# EasyEDA Pro project ELECAP.eprj, schematic Signal_process
Create Date: 2024-07-16; Page Name: P1; Project Name: ELECAP; Schematic Name: Signal_process; Update Date: 2024-07-20; Company: 嘉立创EDA; Page Size: A4; Version: V1.0
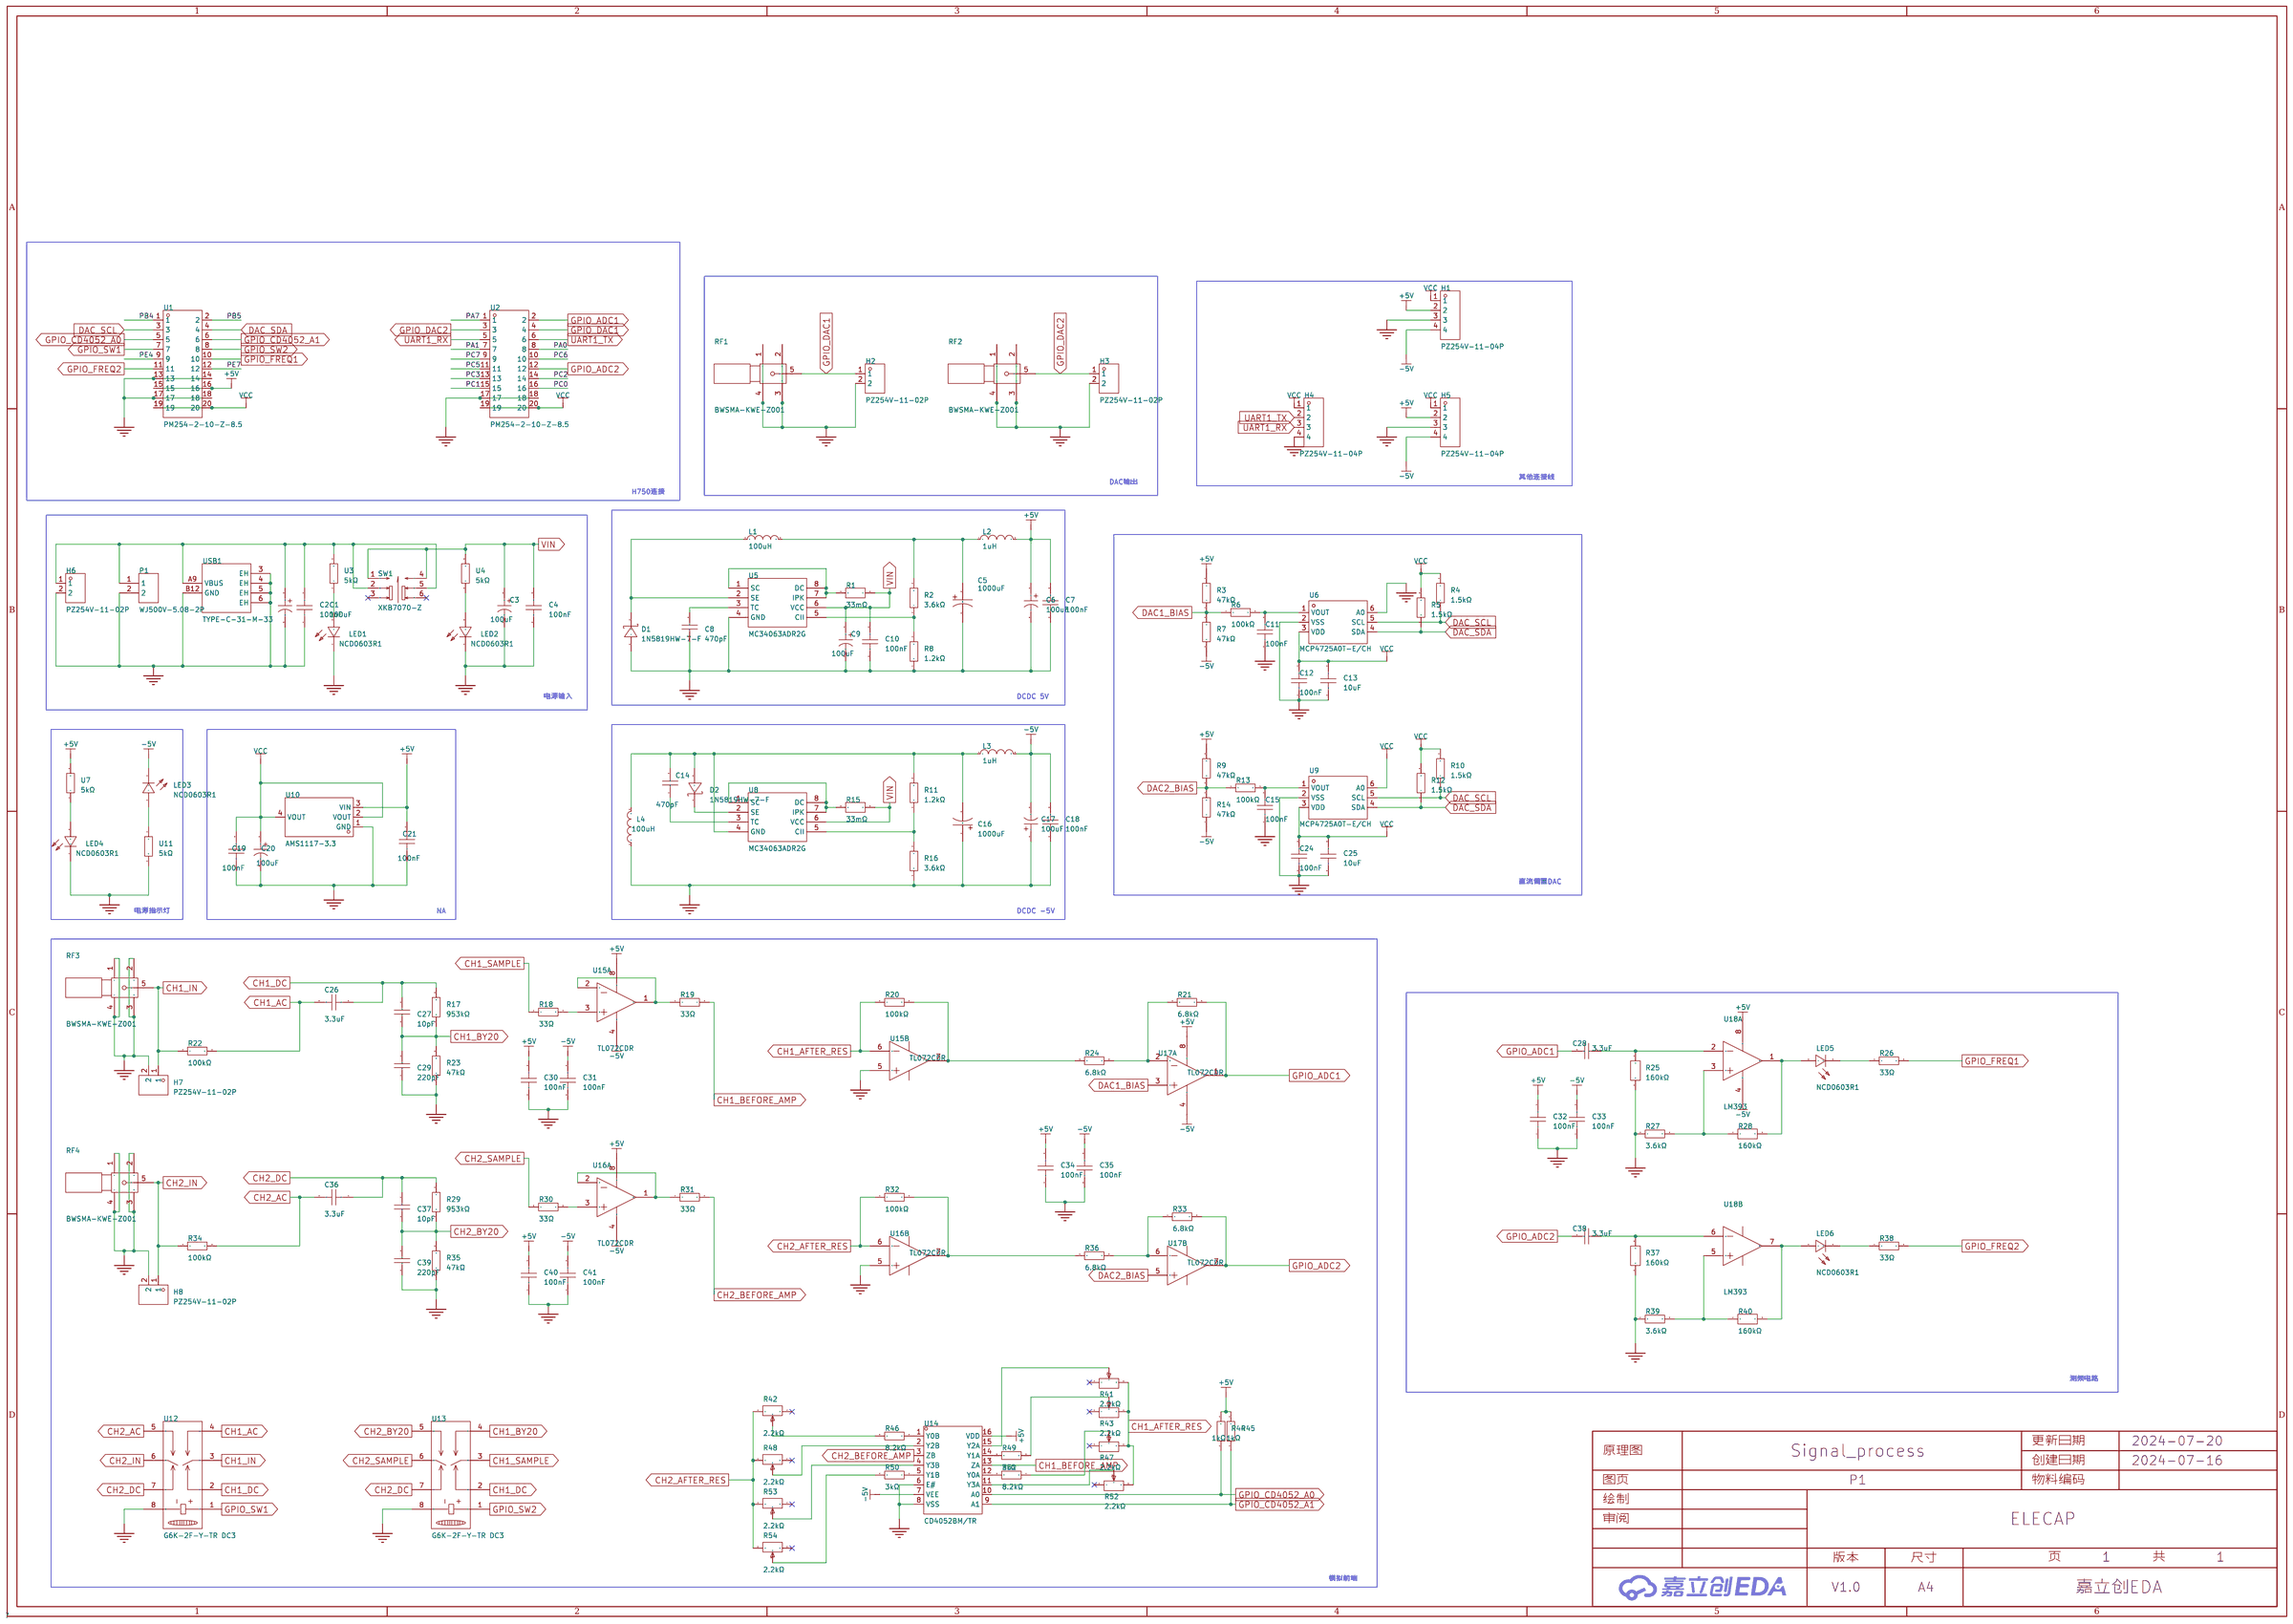
[diagram p0: schematic sheet]

## Parts
C1  100uF  [CAP-SMD_BD6.3-L6.6-W6.6-LS7.4-FD]
C2  100nF  [C0603]
C3  100uF  [CAP-SMD_BD6.3-L6.6-W6.6-LS7.4-FD]
C4  100nF  [C0603]
C5  1000uF  [CAP-TH_BD10.0-P5.00-D1.0-FD]
C6  100uF  [CAP-SMD_BD6.3-L6.6-W6.6-LS7.4-FD]
C7  100nF  [C0603]
C8  470pF  [C0603]
C9  100uF  [CAP-SMD_BD6.3-L6.6-W6.6-LS7.4-FD]
C10  100nF  [C0603]
C11  100nF  [C0603]
C12  100nF  [C0603]
C13  10uF  [C0603]
C14  470pF  [C0603]
C15  100nF  [C0603]
C16  1000uF  [CAP-TH_BD10.0-P5.00-D1.0-FD]
C17  100uF  [CAP-SMD_BD6.3-L6.6-W6.6-LS7.4-FD]
C18  100nF  [C0603]
C19  100nF  [C0603]
C20  100uF  [CAP-SMD_BD6.3-L6.6-W6.6-LS7.4-FD]
C21  100nF  [C0603]
C24  100nF  [C0603]
C25  10uF  [C0603]
C26  3.3uF  [C0603]
C27  10pF  [C0603]
C28  3.3uF  [C0603]
C29  220pF  [C0603]
C30  100nF  [C0603]
C31  100nF  [C0603]
C32  100nF  [C0603]
C33  100nF  [C0603]
C34  100nF  [C0603]
C35  100nF  [C0603]
C36  3.3uF  [C0603]
C37  10pF  [C0603]
C38  3.3uF  [C0603]
C39  220pF  [C0603]
C40  100nF  [C0603]
C41  100nF  [C0603]
D1  1N5819HW-7-F  [SOD-123_L2.7-W1.6-LS3.7-RD]
D2  1N5819HW-7-F  [SOD-123_L2.7-W1.6-LS3.7-RD]
H1  PZ254V-11-04P  [HDR-TH_4P-P2.54-V-M]
H2  PZ254V-11-02P  [HDR-TH_2P-P2.54-V-M]
H3  PZ254V-11-02P  [HDR-TH_2P-P2.54-V-M]
H4  PZ254V-11-04P  [HDR-TH_4P-P2.54-V-M]
H5  PZ254V-11-04P  [HDR-TH_4P-P2.54-V-M]
H6  PZ254V-11-02P  [HDR-TH_2P-P2.54-V-M]
H7  PZ254V-11-02P  [HDR-TH_2P-P2.54-V-M]
H8  PZ254V-11-02P  [HDR-TH_2P-P2.54-V-M]
L1  100uH  [IND-SMD_L7.1-W6.6]
L2  1uH  [IND-SMD_L4.4-W4.2]
L3  1uH  [IND-SMD_L4.4-W4.2]
L4  100uH  [IND-SMD_L7.1-W6.6]
LED1  NCD0603R1  [LED0603-RD_RED]
LED2  NCD0603R1  [LED0603-RD_RED]
LED3  NCD0603R1  [LED0603-RD_RED]
LED4  NCD0603R1  [LED0603-RD_RED]
LED5  NCD0603R1  [LED0603-RD_RED]
LED6  NCD0603R1  [LED0603-RD_RED]
P1  WJ500V-5.08-2P  [CONN-TH_2P-P5.00_WJ500V-5.08-2P]
R1  33mΩ  [R2512]
R2  3.6kΩ  [R0603]
R3  47kΩ  [R0603]
R4  1.5kΩ  [R0603]
R5  1.5kΩ  [R0603]
R6  100kΩ  [R0603]
R7  47kΩ  [R0603]
R8  1.2kΩ  [R0603]
R9  47kΩ  [R0603]
R10  1.5kΩ  [R0603]
R11  1.2kΩ  [R0603]
R12  1.5kΩ  [R0603]
R13  100kΩ  [R0603]
R14  47kΩ  [R0603]
R15  33mΩ  [R2512]
R16  3.6kΩ  [R0603]
R17  953kΩ  [R0603]
R18  33Ω  [R0603]
R19  33Ω  [R0603]
R20  100kΩ  [R0603]
R21  6.8kΩ  [R0603]
R22  100kΩ  [R0603]
R23  47kΩ  [R0603]
R24  6.8kΩ  [R0603]
R25  160kΩ  [R0603]
R26  33Ω  [R0603]
R27  3.6kΩ  [R0603]
R28  160kΩ  [R0603]
R29  953kΩ  [R0603]
R30  33Ω  [R0603]
R31  33Ω  [R0603]
R32  100kΩ  [R0603]
R33  6.8kΩ  [R0603]
R34  100kΩ  [R0603]
R35  47kΩ  [R0603]
R36  6.8kΩ  [R0603]
R37  160kΩ  [R0603]
R38  33Ω  [R0603]
R39  3.6kΩ  [R0603]
R40  160kΩ  [R0603]
R41  2.2kΩ  [RES-ADJ-SMD_VG039NCH]
R42  2.2kΩ  [RES-ADJ-SMD_VG039NCH]
R43  2.2kΩ  [RES-ADJ-SMD_VG039NCH]
R44  1kΩ  [R0603]
R45  1kΩ  [R0603]
R46  8.2kΩ  [R0603]
R47  2.2kΩ  [RES-ADJ-SMD_VG039NCH]
R48  2.2kΩ  [RES-ADJ-SMD_VG039NCH]
R49  3kΩ  [R0603]
R50  3kΩ  [R0603]
R51  8.2kΩ  [R0603]
R52  2.2kΩ  [RES-ADJ-SMD_VG039NCH]
R53  2.2kΩ  [RES-ADJ-SMD_VG039NCH]
R54  2.2kΩ  [RES-ADJ-SMD_VG039NCH]
RF1  BWSMA-KWE-Z001  [SMA-TH_BWSMA-KWE-Z001]
RF2  BWSMA-KWE-Z001  [SMA-TH_BWSMA-KWE-Z001]
RF3  BWSMA-KWE-Z001  [SMA-TH_BWSMA-KWE-Z001]
RF4  BWSMA-KWE-Z001  [SMA-TH_BWSMA-KWE-Z001]
SW1  XKB7070-Z  [SW-TH_6P-L7.0-W7.0-P2.00]
U1  PM254-2-10-Z-8.5  [HDR-TH_20P-P2.54-V-F-R2-C10-S2.54]
U2  PM254-2-10-Z-8.5  [HDR-TH_20P-P2.54-V-F-R2-C10-S2.54]
U3  5kΩ  [R0603]
U4  5kΩ  [R0603]
U5  MC34063ADR2G  [SOIC-8_L5.0-W4.0-P1.27-LS6.0-BL]
U6  MCP4725A0T-E/CH  [SOT-23-6_L2.9-W1.6-P0.95-LS2.8-BL]
U7  5kΩ  [R0603]
U8  MC34063ADR2G  [SOIC-8_L5.0-W4.0-P1.27-LS6.0-BL]
U9  MCP4725A0T-E/CH  [SOT-23-6_L2.9-W1.6-P0.95-LS2.8-BL]
U10  AMS1117-3.3  [SOT-223-3_L6.5-W3.4-P2.30-LS7.0-BR]
U11  5kΩ  [R0603]
U12  G6K-2F-Y-TR DC3  [RELAY-SMD_G6K-2F-Y]
U13  G6K-2F-Y-TR DC3  [RELAY-SMD_G6K-2F-Y]
U14  CD4052BM/TR  [SOP-16_L10.0-W3.9-P1.27-LS6.0-BL]
U15  TL072CDR  [SOIC-8_L4.9-W3.9-P1.27-LS6.1-BL]  (sections 1,2)
U16  TL072CDR  [SOIC-8_L4.9-W3.9-P1.27-LS6.1-BL]  (sections 1,2)
U17  TL072CDR  [SOIC-8_L4.9-W3.9-P1.27-LS6.1-BL]  (sections 1,2)
U18  LM393  [SOP-8_L4.9-W3.9-P1.27-LS6.0-BL]  (sections 1,2)
USB1  TYPE-C-31-M-33  [USB-C-TH_TYPE-C-31-M-33]

## Library data of the parts
C1 C3 C6 C9 C17 C20 = RVT100UF35V67RV0034: 容值:100uF;精度:±20%;额定电压:35V;纹波电流:87mA@120kHz;等效串联电阻:-;; LCSC Part Name: 100uF ±20% 35V; Supplier Part: C2836442; Manufacturer: KNSCHA(科尼盛); Supplier Footprint: SMD,D6.3xL7.7mm; JLCPCB Part Class: 扩展库; Datasheet: https://atta.szlcsc.com/upload/public/pdf/source/20210528/C2836442_7F6389BF36F63F32D6DF3A507E8E95D6.pdf; Supplier: LCSC; Tolerance: ±20%; Rated Voltage: 35V; Ripple Current: 87mA@120kHz; φD: 6.3mm; L: 7.7mm; Lifetime @ Temp: 2000hrs@105℃; Operating Temperature: -55℃~+105℃
C2 C4 C7 C10-C12 C15 C18 C19 C21 C24 C30-C35 C40 C41 = CC0603KRX7R9BB104: 容值:100nF;精度:±10%;额定电压:50V;材质(温度系数):X7R;; LCSC Part Name: 100nF ±10% 50V; Supplier Part: C14663; Manufacturer: YAGEO(国巨); Supplier Footprint: 0603; JLCPCB Part Class: 基础库; Datasheet: https://atta.szlcsc.com/upload/public/pdf/source/20180910/C282072_33301C7F631E79921B82A8DAC6BCC5B3.pdf; Supplier: LCSC; Tolerance: ±10%; Voltage Rated: 50V; Temperature Coefficient: X7R
C5 C16 = ERR1VM102G20OT: 容值:1000uF;精度:±20%;额定电压:35V;; LCSC Part Name: 1000uF ±20% 35V; Supplier Part: C398835; Manufacturer: AISHI(艾华集团); Supplier Footprint: 插件,D10xL20mm; JLCPCB Part Class: 扩展库; Datasheet: https://atta.szlcsc.com/upload/public/pdf/source/20190702/C401591_1676EF45BC9A88BD1D6B22BBAE3913C7.pdf; Supplier: LCSC; Tolerance: ±20%; Rated Voltage: 35V; Lead Spacing: 5mm; φD: 10mm; L: 20mm; Lifetime @ Temp: 2000hrs@105℃
C8 C14 = 0603B471K500NT: 容值:470pF;精度:±10%;额定电压:50V;材质(温度系数):X7R;; LCSC Part Name: 470pF ±10% 50V; Supplier Part: C1620; Manufacturer: FH(风华); Supplier Footprint: 0603; JLCPCB Part Class: 基础库; Datasheet: https://atta.szlcsc.com/upload/public/pdf/source/20200305/C486355_26A10D38EF8C2A5C37091D0039909270.pdf; Supplier: LCSC; Tolerance: ±10%; Voltage Rated: 50V; Temperature Coefficient: X7R
C13 C25 = CL10A106MQ8NNNC: 容值:10uF;精度:±20%;额定电压:6.3V;材质(温度系数):X5R;; LCSC Part Name: 10uF ±20% 6.3V; Supplier Part: C1691; Manufacturer: SAMSUNG(三星); Supplier Footprint: 0603; JLCPCB Part Class: 扩展库; Datasheet: https://atta.szlcsc.com/upload/public/pdf/source/20160218/1457707763339.pdf; Supplier: LCSC; Tolerance: ±20%; Voltage Rated: 6.3V; Temperature Coefficient: X5R
C26 C36 = C1608X5R1E335KT000E: 容值:3.3uF;精度:±10%;额定电压:25V;材质(温度系数):X5R;; LCSC Part Name: 3.3uF ±10% 25V; Supplier Part: C342962; Manufacturer: TDK; Supplier Footprint: 0603; JLCPCB Part Class: 扩展库; Datasheet: https://atta.szlcsc.com/upload/public/pdf/source/20190612/C361180_85CC9FB0751BEA97238DE56AB4AF0B1F.pdf; Supplier: LCSC; Tolerance: ±10%; Voltage Rated: 25V; Temperature Coefficient: X5R
C27 C37 = CL10C100JB8NNNC: 容值:10pF;精度:±5%;额定电压:50V;材质(温度系数):C0G;; LCSC Part Name: 10pF ±5% 50V; Supplier Part: C1634; Manufacturer: SAMSUNG(三星); Supplier Footprint: 0603; JLCPCB Part Class: 基础库; Datasheet: https://atta.szlcsc.com/upload/public/pdf/source/20160218/1457707763339.pdf; Supplier: LCSC; Tolerance: ±5%; Voltage Rated: 50V; Temperature Coefficient: C0G
C28 C38 = CL10A335KP8NNNC: 容值:3.3uF;精度:±10%;额定电压:10V;材质(温度系数):X5R;; LCSC Part Name: 3.3uF ±10% 10V; Supplier Part: C51412; Manufacturer: SAMSUNG(三星); Supplier Footprint: 0603; JLCPCB Part Class: 扩展库; Datasheet: https://atta.szlcsc.com/upload/public/pdf/source/20160218/1457707763339.pdf; Supplier: LCSC; Tolerance: ±10%; Voltage Rated: 10V; Temperature Coefficient: X5R
C29 C39 = CL10B221KB8NNNC: 容值:220pF;精度:±10%;额定电压:50V;材质(温度系数):X7R;; LCSC Part Name: 220pF ±10% 50V; Supplier Part: C1603; Manufacturer: SAMSUNG(三星); Supplier Footprint: 0603; JLCPCB Part Class: 基础库; Datasheet: https://atta.szlcsc.com/upload/public/pdf/source/20160218/1457707763339.pdf; Supplier: LCSC; Tolerance: ±10%; Voltage Rated: 50V; Temperature Coefficient: X7R
D1 D2 = 1N5819HW-7-F: 正向压降(Vf):450mV@1A;直流反向耐压(Vr):40V;平均整流电流(Io):1A;; LCSC Part Name: 电压:40V 电流:1A; Supplier Part: C82544; Manufacturer: DIODES(美台); Supplier Footprint: SOD-123; JLCPCB Part Class: 扩展库; Datasheet: https://atta.szlcsc.com/upload/public/pdf/source/20161024/1477288459223.pdf; Supplier: LCSC; Forward Voltage (Vf@If): 450mV@1A; Reverse Voltage (Vr): 40V; Average Rectified Current (Io): 1A; Reverse Leakage Current (Ir): 1mA@40V
H1 H4 H5 = PZ254V-11-04P: 插针结构:1x4P;间距:2.54mm;行距:-;圆针/方针:方针;安装类型:直插;排数:单排;总PIN位数:4P;额定电流:3A;额定电压:250V;配合针长度:6mm;塑高:2.5mm;端接针长度:3mm;触头材质:-;工作温度范围:-40℃~+105℃;颜色:黑色;; LCSC Part Name: 间距:2.54mm 1x4P 直插 方针; Supplier Part: C2691448; Manufacturer: XFCN(兴飞); Supplier Footprint: 插件,P=2.54mm; JLCPCB Part Class: Extended Part; Datasheet: https://atta.szlcsc.com/upload/public/pdf/source/20200309/C492403_F9F19131791D08044AD4F84F8E751A34.pdf; Supplier: LCSC; Pin Structure: 1x4P; Pitch: 2.54mm; Circluar Pins/Square Pins: 方针; Mounting Type: 直插; Number of Rows: 单排; Number of Pins: 4P; Current Rating (Max): 3A; Voltage Rating (Max): 250V; Length of Mating Pin: 6mm; Insulation Height: 2.5mm; Length of End Connection Pin: 3mm; Operating Temperature Range: -40℃~+105℃; Color: 黑色
H2 H3 H6-H8 = PZ254V-11-02P: 插针结构:1x2P;间距:2.54mm;行距:-;圆针/方针:方针;安装类型:直插;排数:单排;总PIN位数:2P;额定电流:-;额定电压:-;配合针长度:6mm;塑高:2.5mm;端接针长度:3mm;触头材质:黄铜;触头镀层:-;工作温度范围:-40℃~+105℃;颜色:黑色;; LCSC Part Name: 间距:2.54mm 1x2P 直插 方针; Supplier Part: C492401; Manufacturer: XFCN(兴飞); Supplier Footprint: 插件,P=2.54mm; JLCPCB Part Class: 扩展库; Datasheet: https://atta.szlcsc.com/upload/public/pdf/source/20200309/C492401_A812433581A9B211A7FFA413ADDFF0E5.pdf; Supplier: LCSC; Pin Structure: 1x2P; Pitch: 2.54mm; Circluar Pins/Square Pins: 方针; Mounting Type: 直插; Number of Rows: 单排; Number of Pins: 2P; Length of Mating Pin: 6mm; Insulation Height: 2.5mm; Length of End Connection Pin: 3mm; Contact Material: 黄铜; Operating Temperature Range: -40℃~+105℃; Color: 黑色
L1 L4 = SMMS0650-101M: 电感值:100uH;精度:±20%;额定电流:1.5A;饱和电流(Isat):2A;类型:一体成型电感;; LCSC Part Name: 100uH ±20% 2A; Supplier Part: C2894722; Manufacturer: SXN(顺翔诺); Supplier Footprint: SMD,6.6x7.1mm; JLCPCB Part Class: 扩展库; Datasheet: https://atta.szlcsc.com/upload/public/pdf/source/20210910/523B6BB0C4A09F37806A127B1ABE761D.pdf; Supplier: LCSC; Tolerance: ±20%; Rated Current: 1.5A; Saturation Current (Isat): 2A; DC Resistance (DCR): 720mΩ; Type: 一体成型电感
L2 L3 = FXL0420-1R0-M: 电感值:1uH;精度:±20%;额定电流:6A;饱和电流(Isat):7A;类型:一体成型电感;; LCSC Part Name: 1uH ±20% 7A; Supplier Part: C167203; Manufacturer: cjiang(长江微电); Supplier Footprint: SMD,4.2x4.4mm; JLCPCB Part Class: 扩展库; Datasheet: https://atta.szlcsc.com/upload/public/pdf/source/20230516/FBADA9890E7FBE97C620F1D8B562D733.pdf; Supplier: LCSC; Tolerance: ±20%; Rated Current: 6A; Saturation Current (Isat): 7A; DC Resistance (DCR): 27mΩ; Type: 一体成型电感
LED1-LED6 = NCD0603R1_C84263: 灯头类型:-;发光颜色:红色;正向电压(VF):1.6V~2.6V;功率:65mW;正向电流:20mA;主波长:615nm~630nm;二极管配置:独立二极管;透镜颜色:无色透明透镜;色温:-;发光强度:80mcd~220mcd;发光角度:130°;载带方式:-;工作温度:-30℃~+85℃;; Supplier Part: C84263; Manufacturer: 国星光电; Supplier Footprint: 0603; JLCPCB Part Class: 扩展库; Datasheet: https://atta.szlcsc.com/upload/public/pdf/source/20200820/C84263_DABC6A75E58F576973B407FDBA283D60.pdf; Supplier: LCSC; Emitted Color: 红色; Forward Voltage (VF): 1.6V~2.6V; Power Dissipation: 65mW; Forward Current: 20mA; Dominant Wavelength: 615nm~630nm; Diode Configuration: 独立二极管; Lens Color: 无色透明透镜; Luminous Intensity: 80mcd~220mcd; Viewing Angle: 130°; Operating Temperature: -30℃~+85℃
P1 = WJ500V-5.08-2P: 结构:1x2P;间距:5.08mm;颜色:绿色;安装方式:直插;额定电流:18A;额定电压:250V;排数:1;线规 - AWG:14~30;线规 - 平方毫米:2.5;每排PIN数:2;触头材质:-;触头镀层:-;工作温度范围:-40℃~+105℃;焊接温度(最大值):-;; LCSC Part Name: 1x2P 5.08mm 直插 排数:1 每排P数:2; Supplier Part: C8465; Manufacturer: KANGNEX(康奈克斯电气); Supplier Footprint: 插件,P=5.08mm; JLCPCB Part Class: 扩展库; Datasheet: https://atta.szlcsc.com/upload/public/pdf/source/20191225/C8465_02D34CE5B5B4A53DF5891601D97FA9F4.pdf; Supplier: LCSC; Structure: 1x2P; Pitch: 5.08mm; Color: 绿色; Mounting Style: 直插; Current Rating (Max): 18A; Voltage Rating (Max): 250V; Number of Pins: 2P; Number of Rows: 1; Wire Gauge - AWG: 14~30; Wire Gauge - mm2: 2.5; Number of PINs Per Row: 2; Operating Temperature Range: -40℃~+105℃; Screw Specification: M2.5
R1 R15 = 25121WF330MT4E: 电阻类型:厚膜电阻;阻值:33mΩ;精度:±1%;功率:1W;最大工作电压:200V;; LCSC Part Name: 33mΩ ±1% 1W 厚膜电阻; Supplier Part: C620828; Manufacturer: UNI-ROYAL(厚声); Supplier Footprint: 2512; JLCPCB Part Class: 扩展库; Datasheet: https://atta.szlcsc.com/upload/public/pdf/source/20200306/C422600_1E6D84923E4A46A82E41ADD87F860B5C.pdf; Supplier: LCSC; Type: 厚膜电阻; Tolerance: ±1%; Power(Watts): 1W; Overload Voltage (Max): 200V; Operating Temperature Range: -55℃~+155℃
R2 R16 = 0603WAF3601T5E: 电阻类型:厚膜电阻;阻值:3.6kΩ;精度:±1%;功率:100mW;最大工作电压:75V;温度系数:±100ppm/℃;; LCSC Part Name: 3.6kΩ ±1% 100mW 厚膜电阻; Supplier Part: C22980; Manufacturer: UNI-ROYAL(厚声); Supplier Footprint: 0603; JLCPCB Part Class: 基础库; Datasheet: https://atta.szlcsc.com/upload/public/pdf/source/20200306/C422600_1E6D84923E4A46A82E41ADD87F860B5C.pdf; Supplier: LCSC; Type: 厚膜电阻; Tolerance: ±1%; Power(Watts): 100mW; Overload Voltage (Max): 75V; Temperature Coefficient: ±100ppm/℃; Operating Temperature Range: -55℃~+155℃
R3 R7 R9 R14 R23 R35 = 0603WAF4702T5E: 电阻类型:厚膜电阻;阻值:47kΩ;精度:±1%;功率:100mW;最大工作电压:75V;温度系数:±100ppm/℃;; LCSC Part Name: 47kΩ ±1% 100mW 厚膜电阻; Supplier Part: C25819; Manufacturer: UNI-ROYAL(厚声); Supplier Footprint: 0603; JLCPCB Part Class: 基础库; Datasheet: https://atta.szlcsc.com/upload/public/pdf/source/20200306/C422600_1E6D84923E4A46A82E41ADD87F860B5C.pdf; Supplier: LCSC; Type: 厚膜电阻; Tolerance: ±1%; Power(Watts): 100mW; Overload Voltage (Max): 75V; Temperature Coefficient: ±100ppm/℃; Operating Temperature Range: -55℃~+155℃
R4 R5 R10 R12 = 0603WAF1501T5E: 电阻类型:厚膜电阻;阻值:1.5kΩ;精度:±1%;功率:100mW;最大工作电压:75V;温度系数:±100ppm/℃;; LCSC Part Name: 1.5kΩ ±1% 100mW 厚膜电阻; Supplier Part: C22843; Manufacturer: UNI-ROYAL(厚声); Supplier Footprint: 0603; JLCPCB Part Class: 基础库; Datasheet: https://atta.szlcsc.com/upload/public/pdf/source/20200306/C422600_1E6D84923E4A46A82E41ADD87F860B5C.pdf; Supplier: LCSC; Type: 厚膜电阻; Tolerance: ±1%; Power(Watts): 100mW; Overload Voltage (Max): 75V; Temperature Coefficient: ±100ppm/℃; Operating Temperature Range: -55℃~+155℃
R6 R13 R22 R34 = RC0603FR-07100KL: 电阻类型:厚膜电阻;阻值:100kΩ;精度:±1%;功率:100mW;最大工作电压:75V;温度系数:±100ppm/℃;; LCSC Part Name: 厚膜电阻 100kΩ ±1% 100mW; Supplier Part: C14675; Manufacturer: YAGEO(国巨); Supplier Footprint: 0603; JLCPCB Part Class: 扩展库; Datasheet: https://atta.szlcsc.com/upload/public/pdf/source/20140324/1457707028752.pdf; Supplier: LCSC; Type: 厚膜电阻; Tolerance: ±1%; Power(Watts): 100mW; Overload Voltage (Max): 75V; Temperature Coefficient: ±100ppm/℃; Operating Temperature Range: -55℃~+155℃
R8 R11 = 0603WAF1201T5E: 电阻类型:厚膜电阻;阻值:1.2kΩ;精度:±1%;功率:100mW;最大工作电压:75V;温度系数:±100ppm/℃;; LCSC Part Name: 1.2kΩ ±1% 100mW 厚膜电阻; Supplier Part: C22765; Manufacturer: UNI-ROYAL(厚声); Supplier Footprint: 0603; JLCPCB Part Class: 基础库; Datasheet: https://atta.szlcsc.com/upload/public/pdf/source/20200306/C422600_1E6D84923E4A46A82E41ADD87F860B5C.pdf; Supplier: LCSC; Type: 厚膜电阻; Tolerance: ±1%; Power(Watts): 100mW; Overload Voltage (Max): 75V; Temperature Coefficient: ±100ppm/℃; Operating Temperature Range: -55℃~+155℃
R17 R29 = 0603WAF9533T5E: 电阻类型:厚膜电阻;阻值:953kΩ;精度:±1%;功率:100mW;最大工作电压:75V;温度系数:±100ppm/℃;; LCSC Part Name: 953kΩ ±1% 100mW 厚膜电阻; Supplier Part: C246846; Manufacturer: UNI-ROYAL(厚声); Supplier Footprint: 0603; JLCPCB Part Class: 扩展库; Datasheet: https://atta.szlcsc.com/upload/public/pdf/source/20200306/C422600_1E6D84923E4A46A82E41ADD87F860B5C.pdf; Supplier: LCSC; Type: 厚膜电阻; Tolerance: ±1%; Power(Watts): 100mW; Overload Voltage (Max): 75V; Temperature Coefficient: ±100ppm/℃; Operating Temperature Range: -55℃~+155℃
R18 R19 R26 R30 R31 R38 = 0603WAF330JT5E: 电阻类型:厚膜电阻;阻值:33Ω;精度:±1%;功率:100mW;最大工作电压:75V;温度系数:±100ppm/℃;; LCSC Part Name: 33Ω ±1% 100mW 厚膜电阻; Supplier Part: C23140; Manufacturer: UNI-ROYAL(厚声); Supplier Footprint: 0603; JLCPCB Part Class: 基础库; Datasheet: https://atta.szlcsc.com/upload/public/pdf/source/20200306/C422600_1E6D84923E4A46A82E41ADD87F860B5C.pdf; Supplier: LCSC; Type: 厚膜电阻; Tolerance: ±1%; Power(Watts): 100mW; Overload Voltage (Max): 75V; Temperature Coefficient: ±100ppm/℃; Operating Temperature Range: -55℃~+155℃
R20 R32 = RC0603FR-07100KL: 电阻类型:厚膜电阻;阻值:100kΩ;精度:±1%;功率:100mW;最大工作电压:75V;温度系数:±100ppm/℃;; LCSC Part Name: 厚膜电阻 100kΩ ±1% 100mW; Supplier Part: C14675; Manufacturer: YAGEO(国巨); Supplier Footprint: 0603; JLCPCB Part Class: Extended Part; Datasheet: https://atta.szlcsc.com/upload/public/pdf/source/20140324/1457707028752.pdf; Supplier: LCSC; Type: 厚膜电阻; Tolerance: ±1%; Power(Watts): 100mW; Overload Voltage (Max): 75V; Temperature Coefficient: ±100ppm/℃; Operating Temperature Range: -55℃~+155℃
R21 R24 R33 R36 = 0603WAJ0682T5E: 电阻类型:厚膜电阻;阻值:6.8kΩ;精度:±5%;功率:100mW;最大工作电压:75V;温度系数:±100ppm/℃;; LCSC Part Name: 6.8kΩ ±5% 100mW 厚膜电阻; Supplier Part: C26004; Manufacturer: UNI-ROYAL(厚声); Supplier Footprint: 0603; JLCPCB Part Class: 扩展库; Datasheet: https://atta.szlcsc.com/upload/public/pdf/source/20200306/C422600_1E6D84923E4A46A82E41ADD87F860B5C.pdf; Supplier: LCSC; Type: 厚膜电阻; Tolerance: ±5%; Power(Watts): 100mW; Overload Voltage (Max): 75V; Temperature Coefficient: ±100ppm/℃; Operating Temperature Range: -55℃~+155℃
R25 R28 R37 R40 = 0603WAF1603T5E: 电阻类型:厚膜电阻;阻值:160kΩ;精度:±1%;功率:100mW;最大工作电压:75V;温度系数:±100ppm/℃;; LCSC Part Name: 160kΩ ±1% 100mW 厚膜电阻; Supplier Part: C22813; Manufacturer: UNI-ROYAL(厚声); Supplier Footprint: 0603; JLCPCB Part Class: Extended Part; Datasheet: https://atta.szlcsc.com/upload/public/pdf/source/20200306/C422600_1E6D84923E4A46A82E41ADD87F860B5C.pdf; Supplier: LCSC; Type: 厚膜电阻; Tolerance: ±1%; Power(Watts): 100mW; Overload Voltage (Max): 75V; Temperature Coefficient: ±100ppm/℃; Operating Temperature Range: -55℃~+155℃
R27 R39 = 0603WAF3601T5E: 电阻类型:厚膜电阻;阻值:3.6kΩ;精度:±1%;功率:100mW;最大工作电压:75V;温度系数:±100ppm/℃;; LCSC Part Name: 3.6kΩ ±1% 100mW 厚膜电阻; Supplier Part: C22980; Manufacturer: UNI-ROYAL(厚声); Supplier Footprint: 0603; JLCPCB Part Class: Basic Part; Datasheet: https://atta.szlcsc.com/upload/public/pdf/source/20200306/C422600_1E6D84923E4A46A82E41ADD87F860B5C.pdf; Supplier: LCSC; Type: 厚膜电阻; Tolerance: ±1%; Power(Watts): 100mW; Overload Voltage (Max): 75V; Temperature Coefficient: ±100ppm/℃; Operating Temperature Range: -55℃~+155℃
R41-R43 R47 R48 R52-R54 = VG039NCHXTB222: 阻值:2.2kΩ;精度:±25%;; LCSC Part Name: 2.2kΩ ±25%; Supplier Part: C145162; Manufacturer: HDK(北陆电气); Supplier Footprint: SMD; JLCPCB Part Class: 扩展库; Datasheet: https://atta.szlcsc.com/upload/public/pdf/source/20171123/C145162_15114111014461137838.pdf; Supplier: LCSC; Tolerance: ±25%
R44 R45 = 0603WAF1001T5E: 电阻类型:厚膜电阻;阻值:1kΩ;精度:±1%;功率:100mW;最大工作电压:75V;温度系数:±100ppm/℃;; LCSC Part Name: 1kΩ ±1% 100mW 厚膜电阻; Supplier Part: C21190; Manufacturer: UNI-ROYAL(厚声); Supplier Footprint: 0603; JLCPCB Part Class: 基础库; Datasheet: https://atta.szlcsc.com/upload/public/pdf/source/20200306/C422600_1E6D84923E4A46A82E41ADD87F860B5C.pdf; Supplier: LCSC; Type: 厚膜电阻; Tolerance: ±1%; Power(Watts): 100mW; Overload Voltage (Max): 75V; Temperature Coefficient: ±100ppm/℃; Operating Temperature Range: -55℃~+155℃
R46 R51 = 0603WAF8201T5E: 电阻类型:厚膜电阻;阻值:8.2kΩ;精度:±1%;功率:100mW;最大工作电压:75V;温度系数:±100ppm/℃;; LCSC Part Name: 8.2kΩ ±1% 100mW 厚膜电阻; Supplier Part: C25981; Manufacturer: UNI-ROYAL(厚声); Supplier Footprint: 0603; JLCPCB Part Class: Basic Part; Datasheet: https://atta.szlcsc.com/upload/public/pdf/source/20200306/C422600_1E6D84923E4A46A82E41ADD87F860B5C.pdf; Supplier: LCSC; Type: 厚膜电阻; Tolerance: ±1%; Power(Watts): 100mW; Overload Voltage (Max): 75V; Temperature Coefficient: ±100ppm/℃; Operating Temperature Range: -55℃~+155℃
R49 R50 = 0603WAF3001T5E: 电阻类型:厚膜电阻;阻值:3kΩ;精度:±1%;功率:100mW;最大工作电压:75V;温度系数:±100ppm/℃;; LCSC Part Name: 3kΩ ±1% 100mW 厚膜电阻; Supplier Part: C4211; Manufacturer: UNI-ROYAL(厚声); Supplier Footprint: 0603; JLCPCB Part Class: Basic Part; Datasheet: https://atta.szlcsc.com/upload/public/pdf/source/20200306/C422600_1E6D84923E4A46A82E41ADD87F860B5C.pdf; Supplier: LCSC; Type: 厚膜电阻; Tolerance: ±1%; Power(Watts): 100mW; Overload Voltage (Max): 75V; Temperature Coefficient: ±100ppm/℃; Operating Temperature Range: -55℃~+155℃
RF1-RF4 = BWSMA-KWE-Z001: 连接器类型:板端;接口类型:内孔;端口数量:1;接口直径:5.3mm;接口长度/高度:-;频率-最大值:-;射频系列:SMA;阻抗:50Ω;样式:弯头;触头材质:-;触头镀层:-;工作温度范围:-;焊接温度(最大值):-;; LCSC Part Name: 内孔 SMA 弯头; Supplier Part: C496551; Manufacturer: BAT WIRELESS(蝙蝠无线); Supplier Footprint: 插件; JLCPCB Part Class: 扩展库; Datasheet: https://atta.szlcsc.com/upload/public/pdf/source/20231017/997A8C2ADA7F8034A89BE1264F38CE52.pdf; Supplier: LCSC; Connector Type: 板端; Interface Type: 内孔; Number of Ports: 1; Interface Diameter: 5.3mm; RF Series: SMA; Impedance: 50Ω; Style: 弯头
SW1 = XKB7070-Z: 自锁/无锁:自锁;安装方式:直插;触点电流:100mA;额定电压 (AC):250V;额定电压 (DC):30V;带灯:不带;作用力:160gf;机械寿命:10万次;; LCSC Part Name: 按键开关   7*7插件自锁 蓝白黑; Supplier Part: C318863; Manufacturer: XKB Connectivity(中国星坤); Supplier Footprint: 插件; JLCPCB Part Class: 扩展库; Datasheet: https://atta.szlcsc.com/upload/public/pdf/source/20211015/75A682A27A424BDE8D93C2CFA14C38FE.pdf; Supplier: LCSC; Self Lock / No Lock: 自锁; Actuator Style: 矩形按钮; Mounting Style: 直插; Contact Current: 100mA; Voltage Rating (AC): 250V; Voltage Rating (DC): 30V; Insulation Resistance: 100MΩ; Actuator/Cap Color: 蓝色; With Lamp: 不带; Pin Style: PC引脚; Operating Force: 160gf; Operating Temperature: -15℃~+55℃; Mechanical Life: 10万次
U1 U2 = PM254-2-10-Z-8.5: 插孔结构:2x10P;间距:2.54mm;行距:2.54mm;圆孔/方孔:方孔;安装类型:直插;排数:双排;总孔位数:20P;额定电流:3A;额定电压:-;插孔方向:顶部;塑高:8.5mm;触头材质:铜合金;工作温度范围:-40℃~+105℃;焊接温度(最大值):260℃@5S;; LCSC Part Name: 2x10P 间距:2.54mm 直插; Supplier Part: C2897411; Manufacturer: HCTL(华灿天禄); Supplier Footprint: 插件,P=2.54mm; JLCPCB Part Class: 扩展库; Datasheet: https://atta.szlcsc.com/upload/public/pdf/source/20230609/3D36CA2C1BFC9FD1C3F709AD9DFEB9C2.pdf; Supplier: LCSC; Holes Structure: 2x10P; Pitch: 2.54mm; Row Spacing: 2.54mm; Circular Hole / Square Hole: 方孔; Mounting Type: 直插; Number of Rows: 双排; Number of Holes: 20P; Current Rating (Max): 3A; Holes Direction: 顶部; Insulation Height: 8.5mm; Contact Material: 铜合金; Operating Temperature Range: -40℃~+105℃; Soldering Temperature(Max): 260℃@5S
U3 U4 U7 U11 = TR0603B5K00P0525Z: 电阻类型:薄膜电阻;阻值:5kΩ;精度:±0.1%;温度系数:±25ppm/℃;; LCSC Part Name: 薄膜电阻 5kΩ ±0.1%; Supplier Part: C3202451; Manufacturer: EVER OHMS(天二科技); Supplier Footprint: 0603; JLCPCB Part Class: 扩展库; Datasheet: https://atta.szlcsc.com/upload/public/pdf/source/20220726/FE5064264752DF21FD7E7D10DEC6F9AA.pdf; Supplier: LCSC; Type: 薄膜电阻; Tolerance: ±0.1%; Temperature Coefficient: ±25ppm/℃; Operating Temperature Range: -55℃~+155℃
U5 U8 = MC34063ADR2G: 功能类型:升压型；降压型;输出类型:可调;输入电压:3V~40V;输出电压:1.25V~40V;输出电流(最大值):1.5A;; Supplier Part: C32078; Manufacturer: onsemi(安森美); Supplier Footprint: SOIC-8; JLCPCB Part Class: Extended Part; Datasheet: https://atta.szlcsc.com/upload/public/pdf/source/20140614/1457707090981.pdf; Supplier: LCSC; Function: 升压型；降压型; Output Type: 可调; Input Voltage: 3V~40V; Output Voltage: 1.25V~40V; Output Current (Max): 1.5A; Switching Frequency: 100kHz; Operating Temperature: 0℃~+70℃@(TA); Synchronous Rectification: 否; Number of Outputs: 1; Topology: 升压式；降压式; Switch tube (built-in/external): 内置
U6 U9 = MCP4725A0T-E/CH: 接口:I2C;电源电压:2.7V~5.5V;分辨率:12位;INL/DNL:±0.2LSB；±2LSB;稳定时间:6us;; Supplier Part: C144198; Manufacturer: MICROCHIP(美国微芯); Supplier Footprint: SOT-23-6; JLCPCB Part Class: 扩展库; Datasheet: https://atta.szlcsc.com/upload/public/pdf/source/20180115/C144198_15159965569901268427.pdf; Supplier: LCSC; Interface: I2C; Output Type: 电压-缓冲; Supply Voltage: 2.7V~5.5V; Resolution: 12位; Integral nonlinearity: ±0.2LSB；±2LSB; Settling Time: 6us; Operating Temperature: -40℃~+125℃
U10 = AMS1117-3.3_C6186: 输出类型:固定;最大输入电压:-;输出电压:3.3V;最大输出电流:1A;电源纹波抑制比(PSRR):72dB@(120Hz);输出极性:正极;; LCSC Part Name: 输出3.3V 1A; Supplier Part: C6186; Manufacturer: AMS; Supplier Footprint: SOT-223; JLCPCB Part Class: 基础库; Datasheet: https://atta.szlcsc.com/upload/public/pdf/source/20180727/C6186_7A095716F0823C02F1997A905E26C086.pdf; Supplier: LCSC; Output Type: 固定; Output Voltage: 3.3V; MAX Output Current: 1A; Power Supply Rejection Ratio (PSRR): 72dB@(120Hz); Dropout Voltage: 1.3V@(800mA); Output Polarity: 正极; Number of Outputs: 1
U12 U13 = G6K-2F-Y-TR DC3: 线圈电压:3V;触点形式:两组转换:2C(双刀双掷-转换);触点容量(电阻负载):-;最大切换电压:60V@DC；125V@AC;最大切换电流:1A;; LCSC Part Name: 3VDC 1A 无锁存; Supplier Part: C2153097; Manufacturer: OMRON(欧姆龙); Supplier Footprint: SMD,6.5x10mm; JLCPCB Part Class: 扩展库; Datasheet: https://atta.szlcsc.com/upload/public/pdf/source/20220125/C1876770_53E5491D4B68F29C4BBD8118E9BAE0E8.pdf; Supplier: LCSC; Coil Voltage: 3V; Contact Form: 两组转换:2C(双刀双掷-转换); Maximum Switching Voltage: 60V@DC；125V@AC; Contact Material: 银+镀金; Maximum Switching Current: 1A; Operate Time: 3ms; Release Time: 3ms; Operating Temperature: -40℃~+70℃
U14 = CD4052BM/TR: 开关电路:-;; LCSC Part Name: CMOS 两路差分四通道多路复用器; Supplier Part: C253890; Manufacturer: HGSEMI(华冠); Supplier Footprint: SOP-16; JLCPCB Part Class: 扩展库; Datasheet: https://atta.szlcsc.com/upload/public/pdf/source/20240320/B79B5A747B00FBDBF760C3E6EFEFE78B.pdf; Supplier: LCSC
U15-U17 = TL072CDR: 增益带宽积(GBP):5.25MHz;输入偏置电流(Ib):65pA;输入失调电压(Vos):3mV;压摆率(SR):13V/us;; Supplier Part: C67473; Manufacturer: TI(德州仪器); Supplier Footprint: SOIC-8; JLCPCB Part Class: 扩展库; Datasheet: https://www.ti.com/cn/lit/gpn/tl072; Supplier: LCSC; Gain Bandwidth Product(GBP): 5.25MHz; Current - Input Bias(Ib): 65pA; Voltage - Input Offset(Vos): 3mV; Slew Rate(SR): 13V/us; Supply Current Per Channel: 1.4mA; Operating Temperature: 0℃~+70℃
U18 = LM393_C400839: 输入失调电压(Vos):3mV;输入偏置电流(Ib):-;轨到轨:-;; Supplier Part: C400839; Manufacturer: IDCHIP(英锐芯); Supplier Footprint: SOP-8; JLCPCB Part Class: 扩展库; Datasheet: https://atta.szlcsc.com/upload/public/pdf/source/20190624/C400839_FC3E4757065A64BC24F9F0B8EF99EFFB.pdf; Supplier: LCSC; Input Offset Voltage (Vos): 3mV; Supply Voltage: 24V; Supply Current: 2.5mA
USB1 = TYPE-C-31-M-33: 连接器类型:Type-C;标准:-;公母:母;端口数量:1;触点数量:2P;安装方式:弯插;额定电流 - 电源:3A;工作温度范围:-30℃~+80℃;; LCSC Part Name: Type-C 母 弯插; Supplier Part: C2848624; Manufacturer: 韩国韩荣; Supplier Footprint: 插件; JLCPCB Part Class: 扩展库; Datasheet: https://atta.szlcsc.com/upload/public/pdf/source/20231031/D475E686242BF2F6A19F76A577F86FCC.pdf; Supplier: LCSC; Connector Type: Type-C; Gender: 母; Number of Ports: 1; Number of Contacts: 2P; Mounting Style: 弯插; Current Rating - Power (Max): 3A; Operating Temperature Range: -30℃~+80℃

## Nets
+5V: C6.1 C7.2 C21.2 C30.2 C32.2 C34.2 C40.2 H1.2 H5.2 L2.2 R3.2 R9.2 R44.2 R45.2 U1.15 U1.16 U7.2 U10.3(VIN) U14.16(VDD) U15.8(VCC+) U16.8(VCC+) U17.8(VCC+) U18.8(VCC)
-5V: C17.2 C18.2 C31.2 C33.2 C35.2 C41.2 H1.4 H5.4 L3.2 LED3.1(K) R7.1 R14.1 U14.7(VEE) U15.4(VCC-) U16.4(VCC-) U17.4(VCC-) U18.4(GND)
GND: C1.2 C2.1 C3.2 C4.1 C5.2 C6.2 C7.1 C8.1 C9.2 C10.1 C11.1 C12.1 C13.1 C15.1 C16.1 C17.1 C18.1 C19.1 C20.2 C21.1 C24.1 C25.1 C29.1 C30.1 C31.1 C32.1 C33.1 C34.1 C35.1 C39.1 C40.1 C41.1 D1.2(A) H1.3 H2.2 H3.2 H4.4 H5.3 H6.2 H7.2 H8.2 L4.1 LED1.1(K) LED2.1(K) LED4.1(K) P1.2 R8.1 R16.1 R23.1 R25.1 R27.1 R35.1 R37.1 R39.1 RF1.1 RF1.2 RF1.3 RF1.4 RF2.1 RF2.2 RF2.3 RF2.4 RF3.1 RF3.2 RF3.3 RF3.4 RF4.1 RF4.2 RF4.3 RF4.4 U1.13 U1.14 U1.17 U1.18 U2.17 U2.18 U5.4(GND) U6.2(VSS) U6.6(A0) U9.2(VSS) U10.1(GND) U11.2 U12.8 U13.8 U14.6(E#) U14.8(VSS) U15.5(2IN+) U16.5(2IN+) USB1.3(EH) USB1.4(EH) USB1.5(EH) USB1.6(EH) USB1.B12(GND)
VCC: C12.2 C13.2 C19.2 C20.1 C24.2 C25.2 H1.1 H4.1 H5.1 R4.2 R5.2 R10.2 R12.2 U1.19 U1.20 U2.19 U2.20 U6.3(VDD) U9.3(VDD) U9.6(A0) U10.2(VOUT) U10.4(VOUT)
VIN: C3.1 C4.2 C9.1 C10.2 R1.1 R15.1 SW1.1 SW1.4 U4.2 U5.6(VCC) U8.6(VCC)
CH1_AC: C26.2 R22.2 U12.4
CH1_AFTER_RES: R20.1 R41.3 R43.3 R47.3 R52.3 U15.6(2IN-)
CH1_BEFORE_AMP: R19.2 U14.13(ZA)
CH1_BY20: C27.1 C29.2 R17.1 R23.2 U13.4
CH1_DC: C26.1 C27.2 R17.2 U12.2 U13.2
CH1_IN: H7.1 R22.1 RF3.5 U12.3
CH1_SAMPLE: R18.1 U13.3
CH2_AC: C36.2 R34.2 U12.5
CH2_AFTER_RES: R32.1 R42.3 R48.3 R53.3 R54.3 U16.6(2IN-)
CH2_BEFORE_AMP: R31.2 U14.3(ZB)
CH2_BY20: C37.1 C39.2 R29.1 R35.2 U13.5
CH2_DC: C36.1 C37.2 R29.2 U12.7 U13.7
CH2_IN: H8.1 R34.1 RF4.5 U12.6
CH2_SAMPLE: R30.1 U13.6
DAC1_BIAS: R3.1 R6.1 R7.2 U17.3(1IN+)
DAC2_BIAS: R9.1 R13.1 R14.2 U17.5(2IN+)
DAC_SCL: R4.1 R10.1 U1.3 U6.5(SCL) U9.5(SCL)
DAC_SDA: R5.1 R12.1 U1.4 U6.4(SDA) U9.4(SDA)
GPIO_ADC1: C28.1 R21.2 U2.2 U17.1(OUT1)
GPIO_ADC2: C38.1 R33.2 U2.12 U17.7(2OUT)
GPIO_CD4052_A0: R44.1 U1.5 U14.10(A0)
GPIO_CD4052_A1: R45.1 U1.6 U14.9(A1)
GPIO_DAC1: H2.1 RF1.5 U2.4
GPIO_DAC2: H3.1 RF2.5 U2.3
GPIO_FREQ1: R26.2 U1.10
GPIO_FREQ2: R38.2 U1.11
GPIO_SW1: U1.7 U12.1
GPIO_SW2: U1.8 U13.1
PA0: U2.8
PA1: U2.7
PA7: U2.1
PB4: U1.1
PB5: U1.2
PC0: U2.16
PC1: U2.15
PC2: U2.14
PC3: U2.13
PC5: U2.11
PC6: U2.10
PC7: U2.9
PE4: U1.9
PE7: U1.12
UART1_RX: H4.3 U2.5
UART1_TX: H4.2 U2.6
$1N1475: LED1.2(A) U3.1
$1N1576: LED2.2(A) U4.1
$1N1922: C8.2 U5.3(TC)
$1N2334: R2.1 R8.2 U5.5(CII)
$1N2471: R1.2 U5.1(SC) U5.7(IPK) U5.8(DC)
$1N2869: C5.1 L1.2 L2.1 R2.2
$1N2953: D1.1(K) L1.1 U5.2(SE)
$1N3516: R11.1 R16.2 U8.5(CII)
$1N3519: R15.2 U8.1(SC) U8.7(IPK) U8.8(DC)
$1N3959: D2.1(K) U8.2(SE)
$1N3963: C14.1 U8.3(TC)
$1N3967: C14.2 C16.2 D2.2(A) L3.1 L4.2 R11.2 U8.4(GND)
$1N4188: LED4.2(A) U7.1
$1N4271: LED3.2(A) U11.1
$1N4579: C1.1 C2.2 H6.1 P1.1 SW1.2 SW1.5 U3.2 USB1.A9(VBUS)
$1N10509: R18.2 U15.3(1IN+)
$1N10723: R19.1 U15.1(OUT1) U15.2(1IN-)
$1N11101: R51.2 U14.12(Y0A)
$1N11140: R49.2 U14.14(Y1A)
$1N11181: R43.2 R49.1
$1N11262: R47.2 R51.1
$1N11378: R52.2 U14.11(Y3A)
$1N12541: R30.2 U16.3(1IN+)
$1N12545: R31.1 U16.1(OUT1) U16.2(1IN-)
$1N15287: R46.1 U14.1(Y0B)
$1N15326: R50.1 U14.5(Y1B)
$1N15478: R42.2 R46.2
$1N15482: R48.2 U14.2(Y2B)
$1N15487: R53.2 U14.4(Y3B)
$1N15492: R50.2 R54.2
$1N17808: C28.2 R25.2 U18.2(INA-)
$1N17849: R27.2 R28.1 U18.3(INA+)
$1N17946: LED5.2(A) R28.2 U18.1(OUTA)
$1N17988: LED5.1(K) R26.1
$1N18439: C38.2 R37.2 U18.6(INB-)
$1N18445: R39.2 R40.1 U18.5(INB+)
$1N18449: LED6.2(A) R40.2 U18.7(OUTB)
$1N18453: LED6.1(K) R38.1
$1N20154: R20.2 R24.1 U15.7(2OUT)
$1N20167: R32.2 R36.1 U16.7(2OUT)
$1N20194: R21.1 R24.2 U17.2(1IN-)
$1N20199: R33.1 R36.2 U17.6(2IN-)
$1N20301: C11.2 R6.2 U6.1(VOUT)
$1N20347: C15.2 R13.2 U9.1(VOUT)
$1N26193: R41.2 U14.15(Y2A)

Not connected (* = marked no-connect by the designer): R41 1*; R42 1*; R43 1*; R47 1*; R48 1*; R52 1*; R53 1*; R54 1*; SW1 3* 6*

## Notes on the sheet
- 其他连接线
- DAC输出
- H750连接
- 电源输入
- DCDC 5V
- 直流偏置DAC
- 电源指示灯
- NA
- DCDC -5V
- 测频电路
- 模拟前端
